# Altium schematic sheet X-DO10_V1.0.SchDoc
size 431 x 406 mm
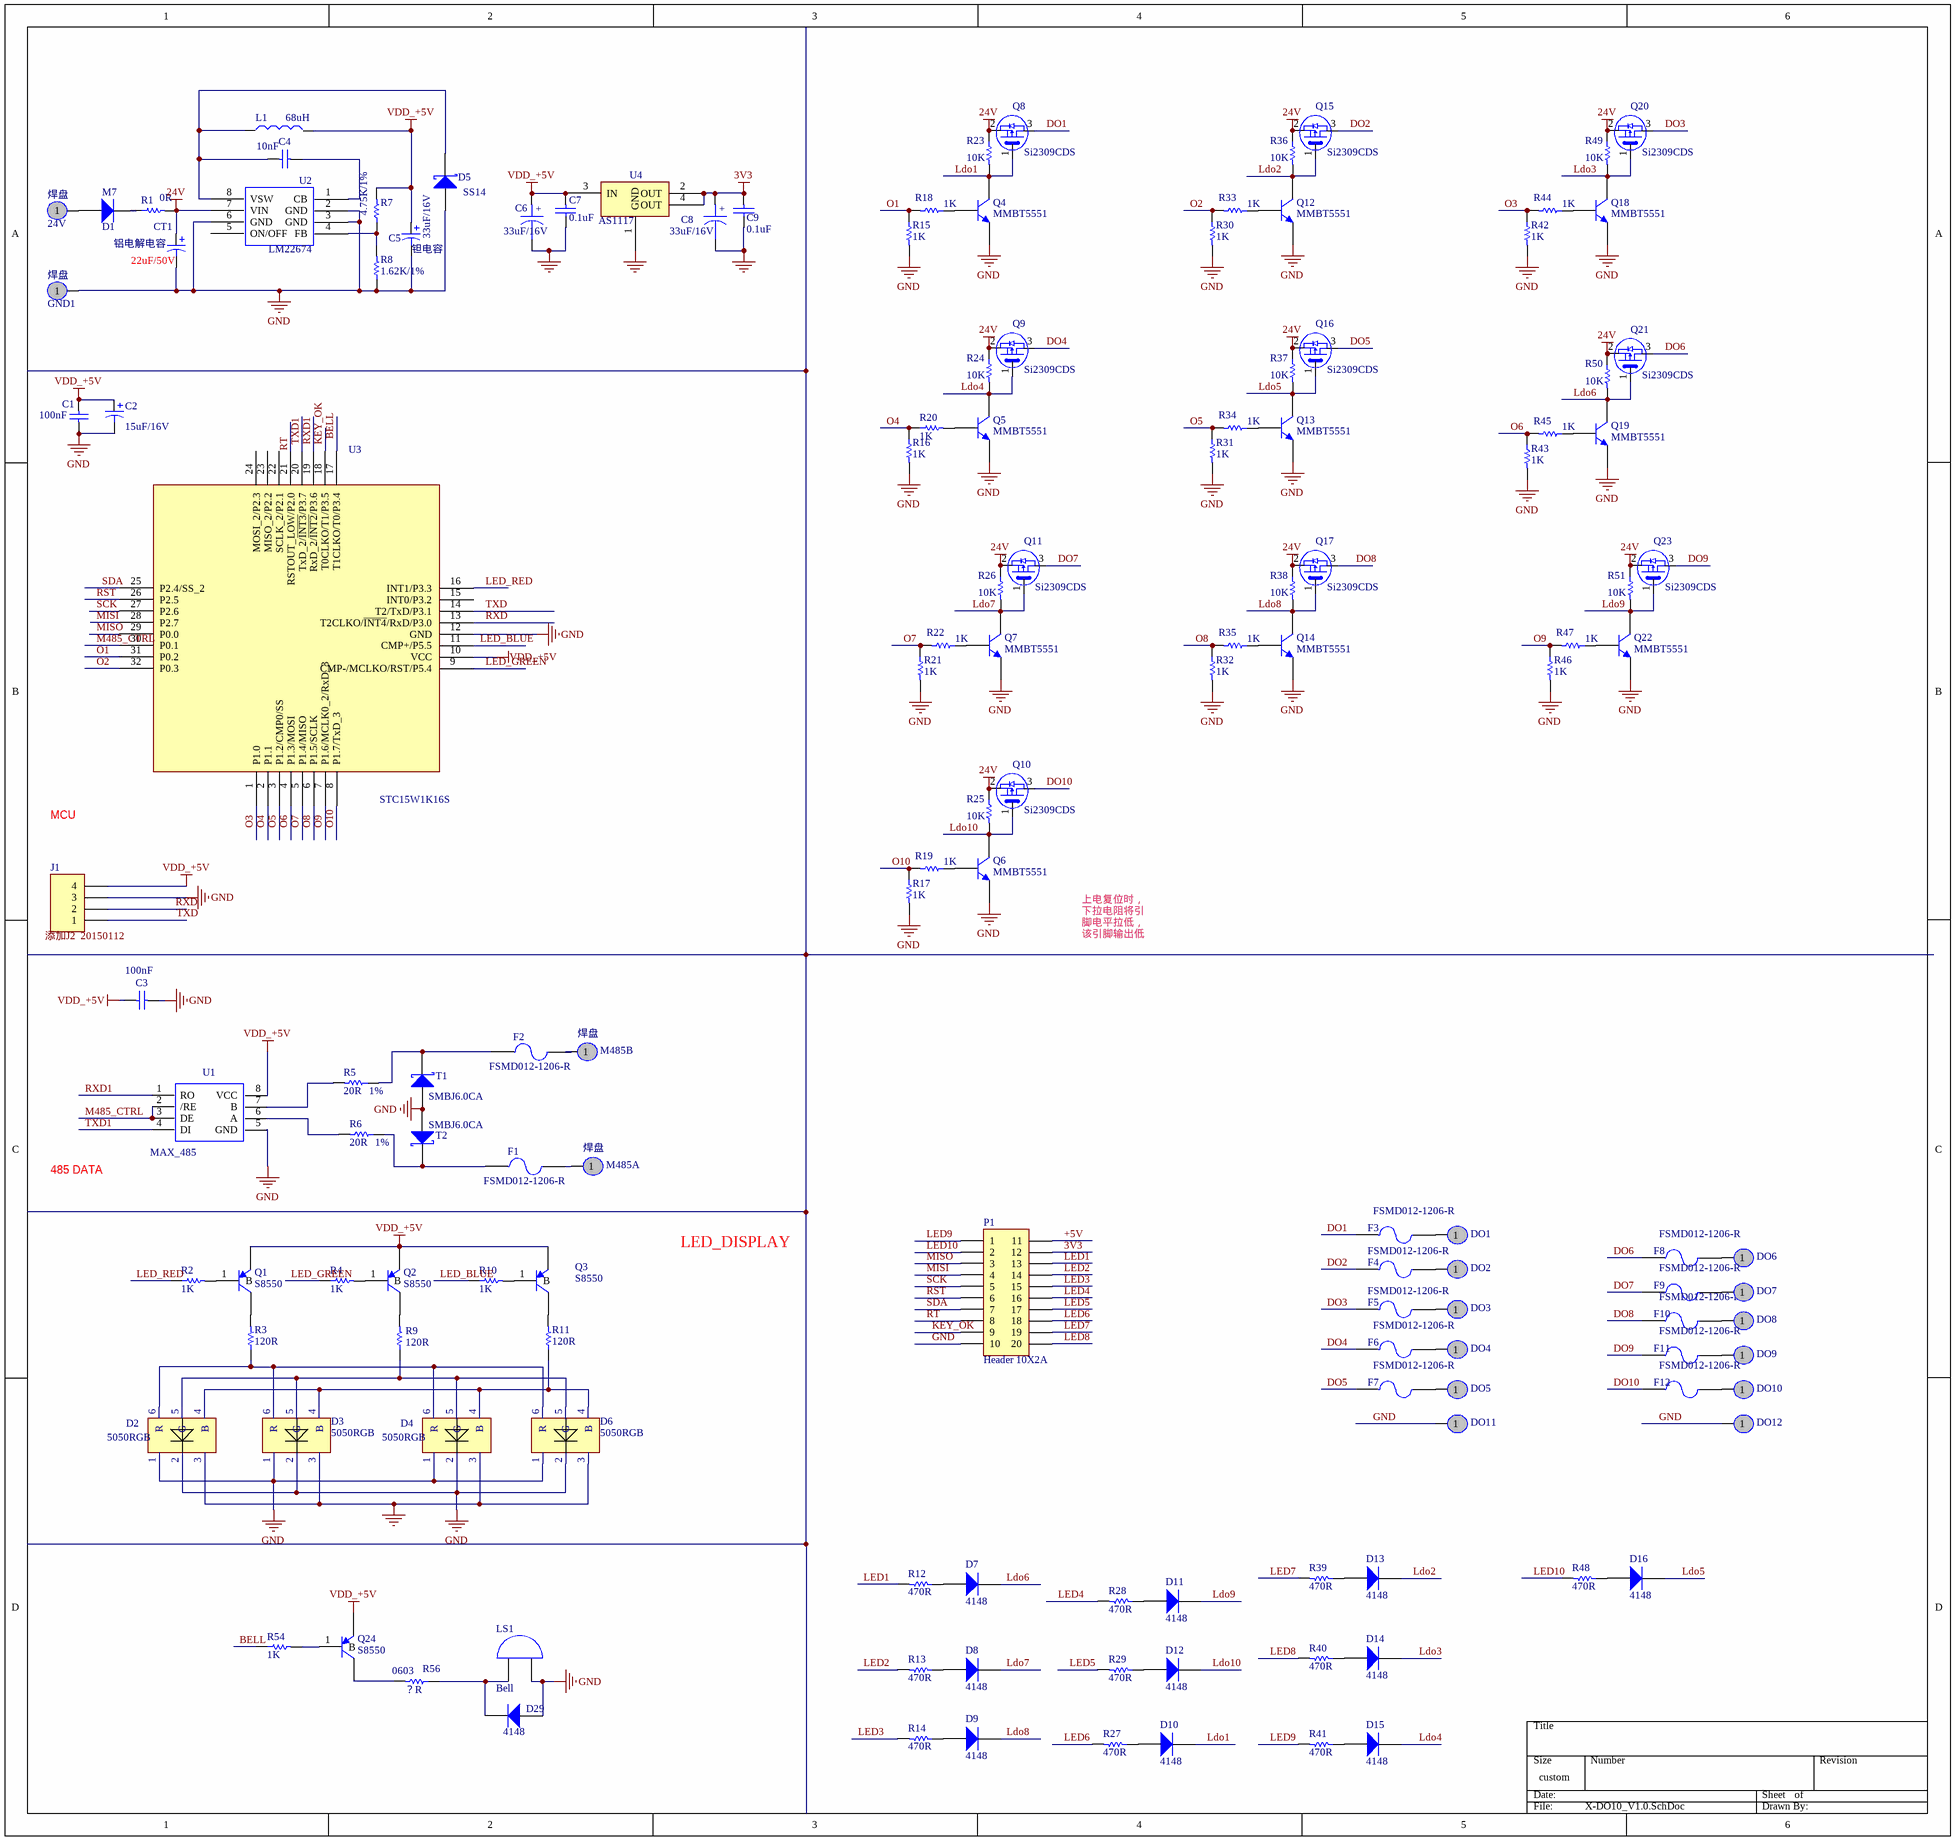
[diagram p0: X-DO10_V1.0.SchDoc]

## Parts
24V  焊盘  [HOLE_SMD]
C1  value 100nF  [C0603]
C2  value 15uF/16V  [1206C]
C3  (no value)  [C0603]
C4  (no value)  [C0603]
C5  钽电容  value 33uF/16V  [CT3528]
C6  33uF/16V  [CT3528]
C7  0.1uF  [C0603]
C8  33uF/16V  [CT3528]
C9  0.1uF  [C0603]
CT1  铝电解电容  [RB0.1]
D1  (no value)  [SMB]
D2  5050RGB  [5050RGB]
D3  5050RGB  [5050RGB]
D4  5050RGB  [5050RGB]
D5  (no value)  [SMB]
D6  5050RGB  [5050RGB]
D7  (no value)  [1206d]
D8  (no value)  [1206d]
D9  (no value)  [1206d]
D10  (no value)  [1206d]
D11  (no value)  [1206d]
D12  (no value)  [1206d]
D13  (no value)  [1206d]
D14  (no value)  [1206d]
D15  (no value)  [1206d]
D16  (no value)  [1206D]
D29  4148  [1206D]
DO1  焊盘  [HOLE_SMD]  (value not drawn)
DO2  焊盘  [HOLE_SMD]  (value not drawn)
DO3  焊盘  [HOLE_SMD]  (value not drawn)
DO4  焊盘  [HOLE_SMD]  (value not drawn)
DO5  焊盘  [HOLE_SMD]  (value not drawn)
DO6  焊盘  [HOLE_SMD]  (value not drawn)
DO7  焊盘  [HOLE_SMD]  (value not drawn)
DO8  焊盘  [HOLE_SMD]  (value not drawn)
DO9  焊盘  [HOLE_SMD]  (value not drawn)
DO10  焊盘  [HOLE_SMD]  (value not drawn)
DO11  焊盘  [HOLE_SMD]  (value not drawn)
DO12  焊盘  [HOLE_SMD]  (value not drawn)
F1  FSMD012-1206-R  [1206]
F2  FSMD012-1206-R  [1206]
F3  FSMD012-1206-R  [1206]
F4  FSMD012-1206-R  [1206]
F5  FSMD012-1206-R  [1206]
F6  FSMD012-1206-R  [1206]
F7  FSMD012-1206-R  [1206]
F8  FSMD012-1206-R  [1206]
F9  FSMD012-1206-R  [1206]
F10  FSMD012-1206-R  [1206]
F11  FSMD012-1206-R  [1206]
F12  FSMD012-1206-R  [1206]
GND1  焊盘  [HOLE_SMD]
J1  (no value)  [SIP4-2.0]
L1  (no value)  [L-6X6]
LS1  Bell  [Bell_DIP_9mm]
M485A  焊盘  [HOLE_SMD]
M485B  焊盘  [HOLE_SMD]
P1  Header 10X2A  [DIP2.0 2*10]
Q1  S8550  [SOT-23]
Q2  S8550  [SOT-23]
Q3  S8550  [SOT-23]
Q4  MMBT5551  [SOT-23]
Q5  MMBT5551  [SOT-23]
Q6  MMBT5551  [SOT-23]
Q7  MMBT5551  [SOT-23]
Q8  Si2309CDS  [SOT-23]
Q9  Si2309CDS  [SOT-23]
Q10  Si2309CDS  [SOT-23]
Q11  Si2309CDS  [SOT-23]
Q12  MMBT5551  [SOT-23]
Q13  MMBT5551  [SOT-23]
Q14  MMBT5551  [SOT-23]
Q15  Si2309CDS  [SOT-23]
Q16  Si2309CDS  [SOT-23]
Q17  Si2309CDS  [SOT-23]
Q18  MMBT5551  [SOT-23]
Q19  MMBT5551  [SOT-23]
Q20  Si2309CDS  [SOT-23]
Q21  Si2309CDS  [SOT-23]
Q22  MMBT5551  [SOT-23]
Q23  Si2309CDS  [SOT-23]
Q24  S8550  [SOT-23]
R1  贴片电阻  [1206]  (value not drawn)
R2  value 1K  [R0603]
R3  value 120R  [2010]
R4  value 1K  [R0603]
R5  (no value)  [2010]
R6  (no value)  [2010]
R7  (no value)  [R0603]
R8  v: 1.62K/1%  [R0603]
R9  value 120R  [2010]
R10  value 1K  [R0603]
R11  value 120R  [2010]
R12  型号: 470R  [r0603]
R13  型号: 470R  [r0603]
R14  型号: 470R  [r0603]
R15  贴片电阻  [R0603]  (value not drawn)
R16  贴片电阻  [R0603]  (value not drawn)
R17  贴片电阻  [R0603]  (value not drawn)
R18  贴片电阻  [R0603]  (value not drawn)
R19  贴片电阻  [R0603]  (value not drawn)
R20  贴片电阻  [R0603]  (value not drawn)
R21  贴片电阻  [R0603]  (value not drawn)
R22  贴片电阻  [R0603]  (value not drawn)
R23  贴片电阻  [R0603]  (value not drawn)
R24  贴片电阻  [R0603]  (value not drawn)
R25  贴片电阻  [R0603]  (value not drawn)
R26  贴片电阻  [R0603]  (value not drawn)
R27  型号: 470R  [r0603]
R28  型号: 470R  [r0603]
R29  型号: 470R  [r0603]
R30  贴片电阻  [R0603]  (value not drawn)
R31  贴片电阻  [R0603]  (value not drawn)
R32  贴片电阻  [R0603]  (value not drawn)
R33  贴片电阻  [R0603]  (value not drawn)
R34  贴片电阻  [R0603]  (value not drawn)
R35  贴片电阻  [R0603]  (value not drawn)
R36  贴片电阻  [R0603]  (value not drawn)
R37  贴片电阻  [R0603]  (value not drawn)
R38  贴片电阻  [R0603]  (value not drawn)
R39  型号: 470R  [r0603]
R40  型号: 470R  [r0603]
R41  型号: 470R  [r0603]
R42  贴片电阻  [R0603]  (value not drawn)
R43  贴片电阻  [R0603]  (value not drawn)
R44  贴片电阻  [R0603]  (value not drawn)
R45  贴片电阻  [R0603]  (value not drawn)
R46  贴片电阻  [R0603]  (value not drawn)
R47  贴片电阻  [R0603]  (value not drawn)
R48  型号: 470R  [r0603]
R49  贴片电阻  [R0603]  (value not drawn)
R50  贴片电阻  [R0603]  (value not drawn)
R51  贴片电阻  [R0603]  (value not drawn)
R54  value 1K  [R0603]
R56  0603  [R0603]
T1  SMBJ6.0CA  [HSMA]
T2  SMBJ6.0CA  [HSMA]
U1  MAX_485  [SO-1.27-8/4.0]
U2  LM22674  [SO-1.27-9/4.0]
U3  STC15W1K16S  [LQFP-0.8-32/9X9]
U4  AS1117  [1117]

## Nets
3V3: C8.1 C9.1 P1.12 U4.2(OUT) U4.4(OUT)
24V: CT1.1 Q8.2(S) Q9.2(S) Q10.2(S) Q11.2(S) Q15.2(S) Q16.2(S) Q17.2(S) Q20.2(S) Q21.2(S) Q23.2(S) R1.2 R23.1 R24.1 R25.1 R26.1 R36.1 R37.1 R38.1 R49.1 R50.1 R51.1 U2.7(VIN)
GND: C1.1 C2.2 C3.1 C5.2 C6.2 C7.2 C8.2 C9.2 CT1.2 D2.1 D2.2 D2.3 D3.1 D3.2 D3.3 D4.1 D4.2 D4.3 D5.1(A) D6.1 D6.2 D6.3 D29.1(A) DO11.1 DO12.1 GND1.1 J1.3 LS1.1(A) P1.10 Q4.2(E) Q5.2(E) Q6.2(E) Q7.2(E) Q12.2(E) Q13.2(E) Q14.2(E) Q18.2(E) Q19.2(E) Q22.2(E) R8.1 R15.2 R16.2 R17.2 R21.2 R30.2 R31.2 R32.2 R42.2 R43.2 R46.2 T1.1(A) T2.1(A) U1.5(GND) U2.2(GND) U2.3(GND) U2.6(GND) U3.12(GND) U4.1(GND)
VDD_+5V: C1.2 C2.1 C3.2 C5.1 C6.1 C7.1 J1.4 L1.2 Q1.2(E) Q2.2(E) Q3.2(E) Q24.2(E) R7.2 U1.8(VCC) U3.10(VCC) U4.3(IN)
+5V: P1.11
BELL: R54.1 U3.17(T1CLKO/T0/P3.4)
DO1: F3.1 Q8.3(D)
DO2: F4.1 Q15.3(D)
DO3: F5.1 Q20.3(D)
DO4: F6.1 Q9.3(D)
DO5: F7.1 Q16.3(D)
DO6: F8.1 Q21.3(D)
DO7: F9.1 Q11.3(D)
DO8: F10.1 Q17.3(D)
DO9: F11.1 Q23.3(D)
DO10: F12.1 Q10.3(D)
KEY_OK: P1.9 U3.18(T0CLKO/T1/P3.5)
Ldo1: D10.2(K) Q4.3(C) Q8.1(G) R23.2
Ldo2: D13.2(K) Q12.3(C) Q15.1(G) R36.2
Ldo3: D14.2(K) Q18.3(C) Q20.1(G) R49.2
Ldo4: D15.2(K) Q5.3(C) Q9.1(G) R24.2
Ldo5: D16.2(K) Q13.3(C) Q16.1(G) R37.2
Ldo6: D7.2(K) Q19.3(C) Q21.1(G) R50.2
Ldo7: D8.2(K) Q7.3(C) Q11.1(G) R26.2
Ldo8: D9.2(K) Q14.3(C) Q17.1(G) R38.2
Ldo9: D11.2(K) Q22.3(C) Q23.1(G) R51.2
Ldo10: D12.2(K) Q6.3(C) Q10.1(G) R25.2
LED1: P1.13 R12.2
LED2: P1.14 R13.2
LED3: P1.15 R14.2
LED4: P1.16 R28.2
LED5: P1.17 R29.2
LED6: P1.18 R27.2
LED7: P1.19 R39.2
LED8: P1.20 R40.2
LED9: P1.1 R41.2
LED10: P1.2 R48.2
LED_BLUE: R10.1 U3.11(CMP+/P5.5)
LED_GREEN: R4.1 U3.9(CMP-/MCLKO/RST/P5.4)
LED_RED: R2.1 U3.16(INT1/P3.3)
M485_CTRL: U1.2(/RE) U1.3(DE) U3.30(P0.1)
MISI: P1.4 U3.28(P2.7)
MISO: P1.3 U3.29(P0.0)
O1: R15.1 R18.2 U3.31(P0.2)
O2: R30.1 R33.2 U3.32(P0.3)
O3: R42.1 R44.2 U3.1(P1.0)
O4: R16.1 R20.1 U3.2(P1.1)
O5: R31.1 R34.2 U3.3(P1.2/CMP0/SS)
O6: R43.1 R45.2 U3.4(P1.3/MOSI)
O7: R21.1 R22.2 U3.5(P1.4/MISO)
O8: R32.1 R35.2 U3.6(P1.5/SCLK)
O9: R46.1 R47.2 U3.7(P1.6/MCLK0_2/RxD_3)
O10: R17.1 R19.2 U3.8(P1.7/TxD_3)
RST: P1.6 U3.26(P2.5)
RT: P1.8 U3.21(RSTOUT_LOW/P2.0)
RXD: J1.2 U3.13(T2CLKO/~{INT4}/RxD/P3.0)
RXD1: U1.1(RO) U3.19(RxD_2/~{INT2}/P3.6)
SCK: P1.5 U3.27(P2.6)
SDA: P1.7 U3.25(P2.4/SS_2)
TXD: J1.1 U3.14(T2/TxD/P3.1)
TXD1: U1.4(DI) U3.20(TxD_2/~{INT3}/P3.7)
Net24V_1: 24V.1 D1.1(A)
NetC4_1: C4.1 U2.1(CB)
NetC4_2: C4.2 D5.2(K) L1.1 U2.8(VSW)
NetD1_2: D1.2(K) R1.1
NetD2_4: D2.4(B) D3.4(B) D4.4(B) D6.4(B) R11.1
NetD2_5: D2.5(G) D3.5(G) D4.5(G) D6.5(G) R9.1
NetD2_6: D2.6(R) D3.6(R) D4.6(R) D6.6(R) R3.1
NetD7_1: D7.1(A) R12.1
NetD8_1: D8.1(A) R13.1
NetD9_1: D9.1(A) R14.1
NetD10_1: D10.1(A) R27.1
NetD11_1: D11.1(A) R28.1
NetD12_1: D12.1(A) R29.1
NetD13_1: D13.1(A) R39.1
NetD14_1: D14.1(A) R40.1
NetD15_1: D15.1(A) R41.1
NetD16_1: D16.1(A) R48.1
NetD29_2: D29.2(K) LS1.2(B) R56.1
NetDO1_1: DO1.1 F3.2
NetDO2_1: DO2.1 F4.2
NetDO3_1: DO3.1 F5.2
NetDO4_1: DO4.1 F6.2
NetDO5_1: DO5.1 F7.2
NetDO6_1: DO6.1 F8.2
NetDO7_1: DO7.1 F9.2
NetDO8_1: DO8.1 F10.2
NetDO9_1: DO9.1 F11.2
NetDO10_1: DO10.1 F12.2
NetF1_1: F1.1 R6.1 T2.2(K)
NetF1_2: F1.2 M485A.1
NetF2_1: F2.1 R5.1 T1.2(K)
NetF2_2: F2.2 M485B.1
NetQ1_1: Q1.1(B) R2.2
NetQ1_3: Q1.3(C) R3.2
NetQ2_1: Q2.1(B) R4.2
NetQ2_3: Q2.3(C) R9.2
NetQ3_1: Q3.1(B) R10.2
NetQ3_3: Q3.3(C) R11.2
NetQ4_1: Q4.1(B) R18.1
NetQ5_1: Q5.1(B) R20.2
NetQ6_1: Q6.1(B) R19.1
NetQ7_1: Q7.1(B) R22.1
NetQ12_1: Q12.1(B) R33.1
NetQ13_1: Q13.1(B) R34.1
NetQ14_1: Q14.1(B) R35.1
NetQ18_1: Q18.1(B) R44.1
NetQ19_1: Q19.1(B) R45.1
NetQ22_1: Q22.1(B) R47.1
NetQ24_1: Q24.1(B) R54.2
NetQ24_3: Q24.3(C) R56.2
NetR5_2: R5.2 U1.7(B)
NetR6_2: R6.2 U1.6(A)
NetR7_1: R7.1 R8.2 U2.4(FB)

Not connected (* = marked no-connect by the designer): U2 5(ON/OFF); U3 15(INT0/P3.2) 22(SCLK_2/P2.1) 23(MISO_2/P2.2) 24(MOSI_2/P2.3)

## Notes on the sheet
- MCU
- (near J1) 添加J2  20150112
- 上电复位时，下拉电阻将引脚电平拉低，该引脚输出低电平
- 485 DATA
- LED_DISPLAY
- (in symbol Cap) 10nF; 100nF
- (in symbol Cap Pol1) 22uF/50V
- (in symbol CAPACITOR POL) +
- (in symbol Diode) M7; 4148
- (in symbol Res Semi) 0R; 4.75K/1%; 20R   1%; 1K; 10K; ？R
- (in symbol SMBJ6.0CA) SS14
- (in symbol 电感) 68uH

## Library data of the parts
C1 C3 C4 = Cap: Capacitor
C2 C5 CT1 = Cap Pol1: Polarized Capacitor (Radial)
C6 C8 = CAPACITOR POL: Capacitor
C7 C9 = CAP: Capacitor
D1 D7-D16 D29 = Diode: Default Diode
  D29: Published: 8-Jun-2000; LatestRevisionDate: 17-Jul-2002; LatestRevisionNote: Re-released for DXP Platform.; PackageDocument: Sep-1996; PackageReference: SMC; Publisher: Altium Limited; Code_JEDEC: DO-214-AB
D5 = SMBJ6.0CA
F1-F12 = Fuse 2: Fuse
J1 = Header 4
L1 = 电感
LS1 = Bell: Electrical Bell; Published: 24-Mar-1999; LatestRevisionDate: 17-Jul-2002; LatestRevisionNote: Re-released for DXP Platform.; PackageReference: PIN2; Publisher: Altium Limited
P1 = Header 10X2A: Header, 10-Pin, Dual row; LatestRevisionDate: 17-Jul-2002; LatestRevisionNote: Re-released for DXP Platform.; Publisher: Altium Limited
Q4-Q7 Q12-Q14 Q18 Q19 Q22 = NPN: NPN Bipolar Transistor; Published: 8-Jun-2000; LatestRevisionDate: 17-Jul-2002; LatestRevisionNote: Re-released for DXP Platform.; PackageReference: TO-226; Publisher: Altium Limited; Code_JEDEC: TO-226-AA
Q8-Q11 Q15-Q17 Q20 Q21 Q23 = P-MOSFET
R1-R11 R15-R26 R30-R38 R42-R47 R49-R51 R54 R56 = Res Semi: Semiconductor Resistor
  R54: Published: 8-Jun-2000; LatestRevisionDate: 17-Jul-2002; LatestRevisionNote: Re-released for DXP Platform.; PackageReference: AXIAL-0.5; Publisher: Altium Limited
R12-R14 R27-R29 R39-R41 R48 = Res Semi: 贴片电阻
U2 = 2674